# Altium schematic sheet IMU.SchDoc
size A4
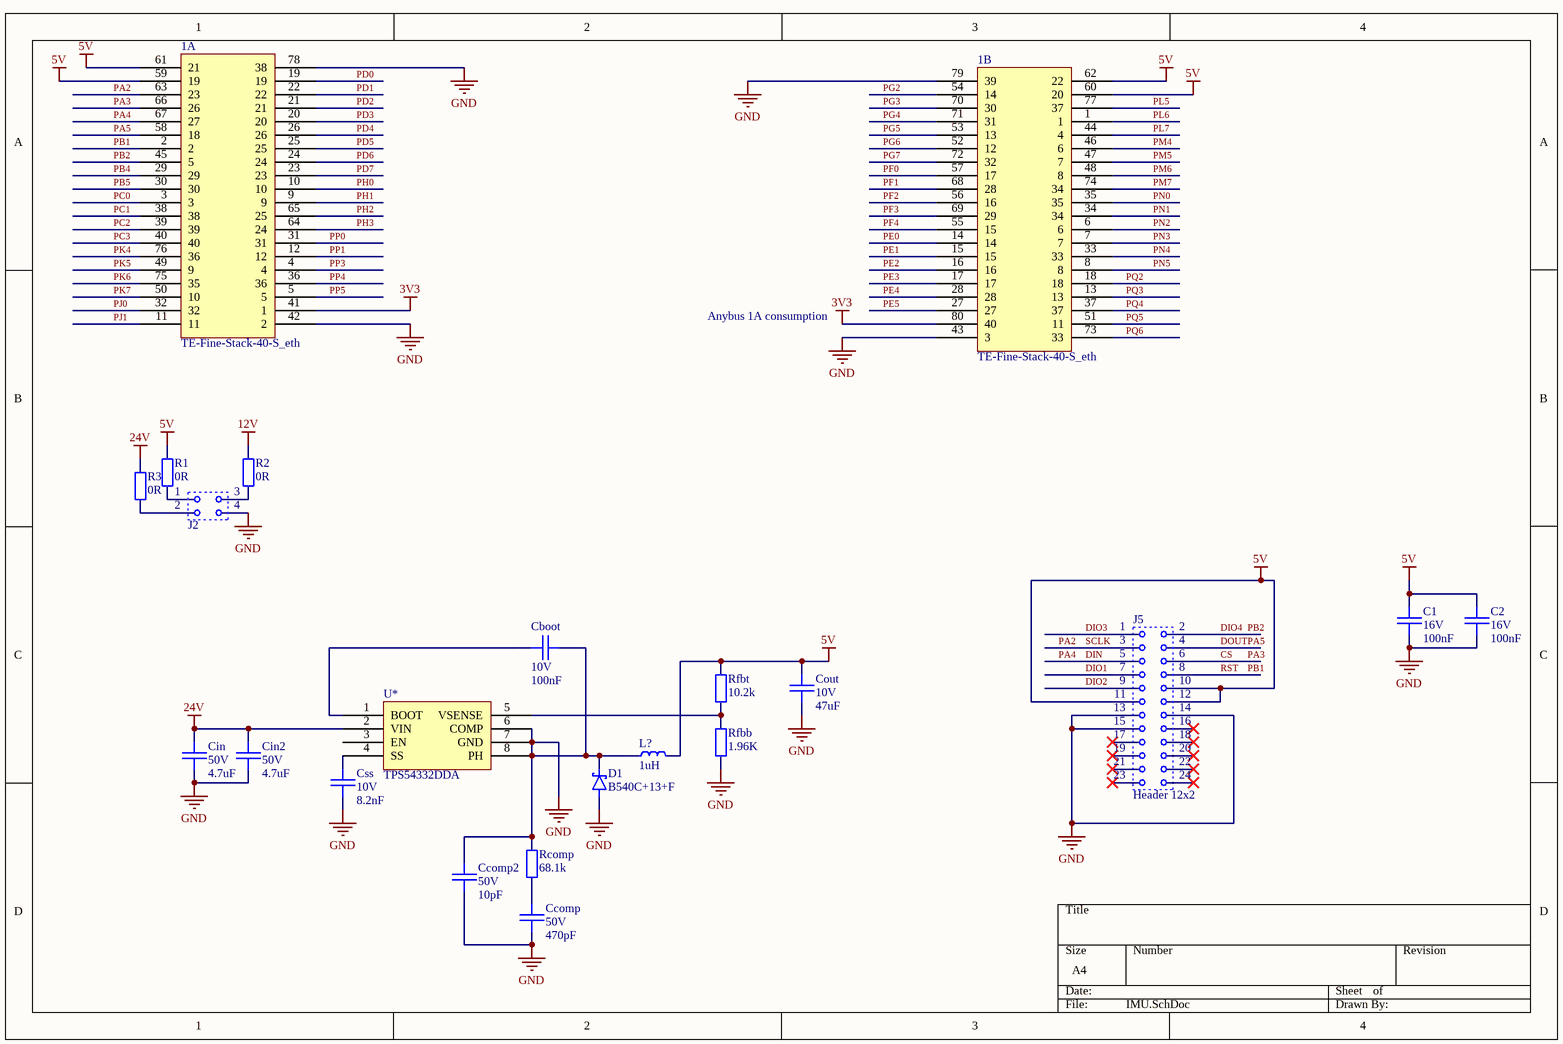
[diagram p0: IMU.SchDoc]

## Parts
1  TE-Fine-Stack-40-S_eth  [TE-FINE-STACK-40-P-Eth]  (parts A,B of 2)
C1  value 100nF  Voltage: 16V  [0805]  (hidden comment: 100n)
C2  value 100nF  Voltage: 16V  [0805]  (hidden comment: 100n)
Cboot  value 100nF  Voltage: 10V  [0805]  (hidden comment: 4.7u)
Ccomp  value 470pF  Voltage: 50V  [0805]  (hidden comment: 4.7u)
Ccomp2  value 10pF  Voltage: 50V  [0805]  (hidden comment: 4.7u)
Cin  value 4.7uF  Voltage: 50V  [0805]  (hidden comment: 4.7u)
Cin2  value 4.7uF  Voltage: 50V  [0805]  (hidden comment: 4.7u)
Cout  value 47uF  Voltage: 10V  [0805]  (hidden comment: 4.7u)
Css  value 8.2nF  Voltage: 10V  [0805]  (hidden comment: 4.7u)
D1  B540C+13+F  [SMB/DO-214AA]
J2  Molex Microfit  [MICROFIT 2x2 Right Angle]  (value not drawn)
J5  Header 12x2  [CLM-112-02]
L?  1uH
R1  0R  [0603_R]
R2  0R  [0603_R]
R3  0R  [0603_R]
Rcomp  68.1k  [0805_R]
Rfbb  1.96K  [0805_R]
Rfbt  10.2k  [0805_R]
U*  TPS54332DDA  [PDSO127P600X170_HS-9N]

## Nets
3V3: 1.41(1) 1.80(40)
5V: 1.59(19) 1.60(20) 1.61(21) 1.62(22) C1.1 C2.1 Cout.1 J5.10 J5.11 J5.12 L?.1 R1.2 Rfbt.2
12V: R2.2
24V: Cin.1 Cin2.1 R3.2 U*.2(VIN)
GND: 1.42(2) 1.43(3) 1.78(38) 1.79(39) C1.2 C2.2 Cboot.2 Ccomp.2 Ccomp2.1 Ccomp2.2 Cin.2 Cin2.2 Cout.2 Css.2 D1.A D1.K J2.4 J5.13 J5.14 J5.15 L?.2 Rcomp.2 Rfbb.1 U*.6(COMP) U*.7(GND) U*.8(PH)
CS: 1.66(26) J5.6  [also labelled PA3]
DIN: 1.67(27) J5.5  [also labelled PA4]
DIO1: J5.7
DIO2: J5.9
DIO3: J5.1
DIO4: 1.45(5) J5.2  [also labelled PB2]
DOUT: 1.58(18) J5.4  [also labelled PA5]
PA2: 1.63(23) J5.3  [also labelled SCLK]
PB1: 1.2 J5.8  [also labelled RST]
PB4: 1.29
PB5: 1.30
PC0: 1.3
PC1: 1.38
PC2: 1.39
PC3: 1.40
PD0: 1.19
PD1: 1.22
PD2: 1.21
PD3: 1.20
PD4: 1.26
PD5: 1.25
PD6: 1.24
PD7: 1.23
PE0: 1.14
PE1: 1.15
PE2: 1.16
PE3: 1.17
PE4: 1.28
PE5: 1.27
PF0: 1.57(17)
PF1: 1.68(28)
PF2: 1.56(16)
PF3: 1.69(29)
PF4: 1.55(15)
PG2: 1.54(14)
PG3: 1.70(30)
PG4: 1.71(31)
PG5: 1.53(13)
PG6: 1.52(12)
PG7: 1.72(32)
PH0: 1.10
PH1: 1.9
PH2: 1.65(25)
PH3: 1.64(24)
PJ0: 1.32
PJ1: 1.11
PK4: 1.76(36)
PK5: 1.49(9)
PK6: 1.75(35)
PK7: 1.50(10)
PL5: 1.77(37)
PL6: 1.1
PL7: 1.44(4)
PM4: 1.46(6)
PM5: 1.47(7)
PM6: 1.48(8)
PM7: 1.74(34)
PN0: 1.35
PN1: 1.34
PN2: 1.6
PN3: 1.7
PN4: 1.33
PN5: 1.8
PP0: 1.31
PP1: 1.12
PP3: 1.4
PP4: 1.36
PP5: 1.5
PQ2: 1.18
PQ3: 1.13
PQ4: 1.37
PQ5: 1.51(11)
PQ6: 1.73(33)
NetCboot_1: Cboot.1 U*.1(BOOT)
NetCcomp_1: Ccomp.1 Rcomp.1
NetCss_1: Css.1 U*.4(SS)
NetJ2_1: J2.1 R1.1
NetJ2_2: J2.2 R3.1
NetJ2_3: J2.3 R2.1
NetRfbb_2: Rfbb.2 Rfbt.1 U*.5(VSENSE)

Not connected (* = marked no-connect by the designer): J5 16* 17* 18* 19* 20* 21* 22* 23* 24*; U* 3(EN)

## Notes on the sheet
- Anybus 1A consumption

## Library data of the parts
C1 C2 Cboot Ccomp Ccomp2 Cin Cin2 Cout Css = C_CER: Ceramic Capacitor
D1 = SK210: Schottky Diode 2A 100V; Supplier: TME; URL: http://www.tme.eu/pl/details/sk210/diody-schottky-smd/dc-components/#; Symbol: B540C+13+F
J2 = Microfit 2x2 Right Angle
L? = L_IND_AIR: Air Core Inductor
R1-R3 Rcomp Rfbb Rfbt = R: Resistor